# EAGLE design charger (EAGLE 7.0.0)
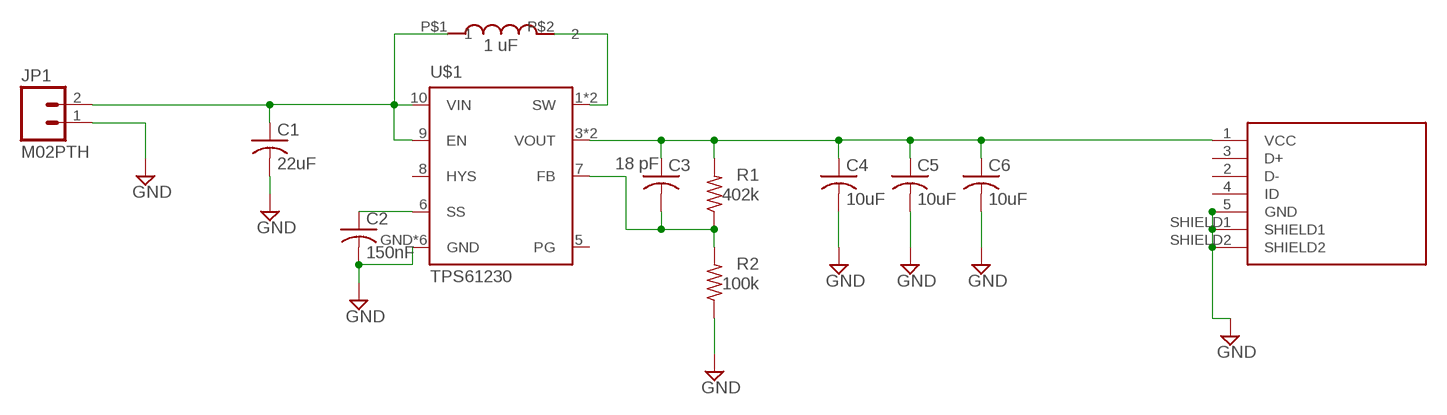
[diagram p0: schematic, sheet 1]

## Parts
C1  22uF  C-USC1206  [C1206]
C2  150nF  C-USC0603K  [C0603K]
C3  18 pF  C-USC0603K  [C0603K]
C4  10uF  C-USC0805K  [C0805K]
C5  10uF  C-USC0805K  [C0805K]
C6  10uF  C-USC0805K  [C0805K]
JP1  M02PTH  [1X02]
R1  402k  R-US_R0603  [R0603]
R2  100k  R-US_R0603  [R0603]
U$1  TPS61230  [DRC-S-PVSON-N11]
U$3  SRU1028  [SRU1028]
U$4  USB2  [USB2]

## Nets
GND: C1.2 C2.2 C4.2 C5.2 C6.2 JP1.1 R2.1 U$1.GND U$1.GND@1(GND) U$1.GND@2(GND) U$1.GND@3(GND) U$1.GND@4(GND) U$1.GND@5(GND) U$4.5(GND) U$4.SHIELD1 U$4.SHIELD2
IND: U$1.1(SW) U$1.2(SW) U$3.P$2
N$3: C2.1 U$1.6(SS)
N$6: C3.2 R1.1 R2.2 U$1.7(FB)
VIN: C1.1 JP1.2 U$1.9(EN) U$1.10(VIN) U$3.P$1
VOUT: C3.1 C4.1 C5.1 C6.1 R1.2 U$1.3(VOUT) U$1.4(VOUT) U$4.1(VCC)
Unconnected: U$1.8(HYS) U$4.2(D-) U$4.3(D+) U$4.4(ID)

## Notes on the sheet
- 1 uF

## Power pins joined to a net without a drawn wire
PG: U$1.5(PG)

## Library data of the parts
C1 C3-C6 = resistor:C-US: CAPACITOR, American symbol
C2 = adafruit:C-US: CAPACITOR, American symbol
JP1 = SparkFun-Connectors:M02: Standard 2-pin 0.1" header. Use with - straight break away headers ( PRT-00116) - right angle break away headers (PRT-00553) - swiss pins (PRT-00743) - machine pins (PRT-00117) - female headers (PRT-00115) Molex polarized connector foot print use with: PRT-08233 with associated crimp pins and housings. 2.54_SCREWTERM for use with PRT-10571. 3.5mm Screw Terminal footprints for PRT-08084 5mm Screw Terminal footprints for use with PRT-08433
R1 R2 = adafruit:R-US_: RESISTOR, American symbol
U$1 = texas:TPS61230
U$3 = ti:SRU1028
U$4 = ti:USB2

## Board
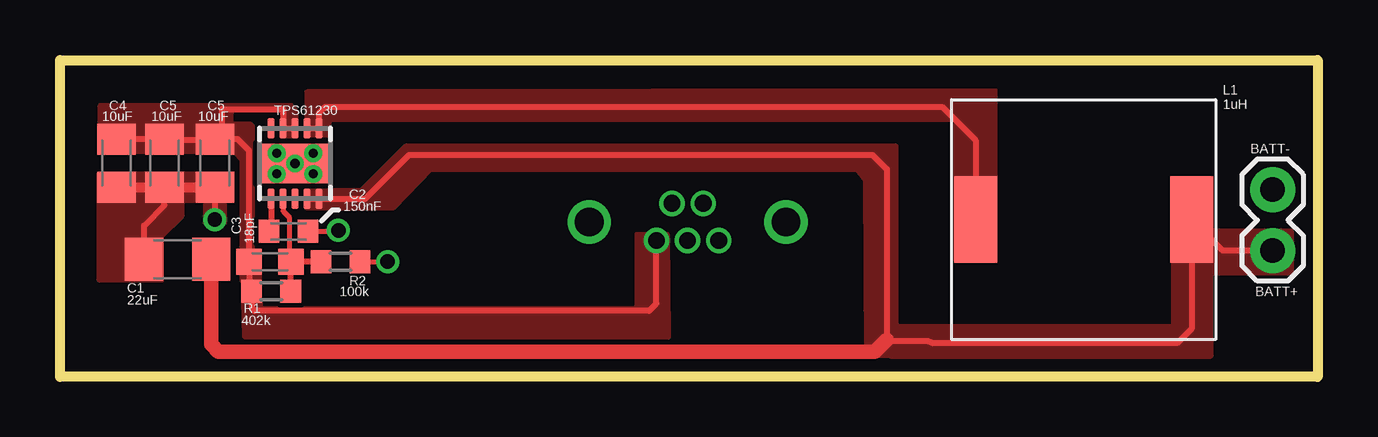
[diagram p1: board, top side]
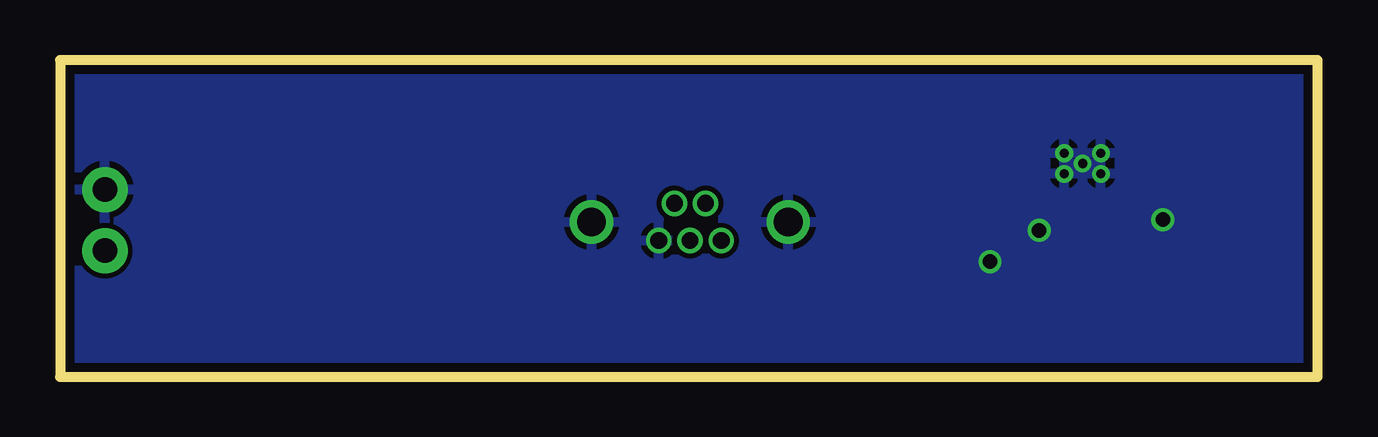
[diagram p2: board, bottom side, seen from below]

Size 52.4 x 13.2 mm. Coordinates in mm from the lower left corner, seen from the top.
Outline: 0,0 0,13.2 52.4,13.2 52.4,0 0,0
Copper layers (1*16): Top 0.0356mm / dielectric 1.5011mm / Bottom 0.0356mm
Design rules "LaenPCBOrder *": minimum track width 6mil, minimum drill 13mil, track to track 8mil, track to pad 8mil, pad to pad 8mil, via to via 8mil, smd to smd 8mil, copper to edge 15mil, drill to drill 6mil, minimum pad ring 7mil, minimum via ring 7mil, stop-mask expansion 0mil, vias tented up to drill 30mil, thermal gap 10mil

### Footprints (pad centres in the part's own frame; a part is rotated, then mirrored left to right if it is on the bottom)
C1206 = smd 1.6 x 1.8: 1 -1.4,0; 2 1.4,0
C0603K = smd 0.864 x 0.965: 1 -0.813,0; 2 0.813,0
C0603K' = smd 1.05 x 1.08: 1 -0.875,0; 2 0.875,0
C0805K = smd 1.3 x 1.6: 1 -1,0; 2 1,0
1X02 = drill 1.016 pad 1.88: 1 0,0; 2 2.54,0
R0603 = smd 0.864 x 0.965: 1 -0.813,0; 2 0.813,0
DRC-S-PVSON-N11 = smd 0.28 x 0.85: 1 -1,-1.475; 2 -0.5,-1.475; 3 0,-1.475; 4 0.5,-1.475; 5 1,-1.475; 6 1,1.475; 7 0.5,1.475; 8 0,1.475; 9 -0.5,1.475; 10 -1,1.475 | smd 3.099 x 1.65: GND 0,0 | drill 0.381 pad 0.559: GND@1 0,0; GND@2 -0.762,0.432; GND@3 -0.762,-0.432; GND@4 0.762,0.432; GND@5 0.762,-0.432
SRU1028 = smd 1.8 x 3.6: P$1 0.9,1.8; P$2 9.9,1.8
USB2 = drill 0.7: 1 2.8,-0.775; 2 3.45,0.775; 3 4.1,-0.775; 4 4.75,0.775; 5 5.4,-0.775 | drill 1.2: SHIELD1 0,0; SHIELD2 8.2,0

### Placement (x,y rotation side)
C1  4.9,4.9 180 top
C2  9.52,6.06 0 top
C3  18 pF  [C0603K']  8.75,4.8 0 top
C4  2.35,8.9 270 top
C5  4.35,8.9 270 top
C6  6.45,8.9 270 top
JP1  50.53,7.8 270 top
R1  8.8,3.57 180 top
R2  11.68,4.79 180 top
U$1  9.79,8.89 180 top
U$3  48.05,8.35 180 top
U$4  22.05,6.45 0 top

### Tracks (layer width: path | path; a pad name or v marks a point on that pad's centre or on a via)
GND  (via drill 0.6)
  Top 0.2: R2.1 13.54,4.79 v13.65,4.8 | C2.2 11.56,6.06 v11.6,6.1
  Top 0.254: C6.2 v6.45,6.55 | C1.2 3.5,6.3 4.35,7.15 C5.2 | U$1.GND@5 9.36,9.32 U$1.GND@1
  Top 0.406: C4.2 C5.2 C6.2
  Bottom 0.254: v6.45,6.55 6.45,6.7
  pour Bottom: 0.1,13.2 52.35,13.2 52.35,0 0.1,0
  pour Top (no thermals): 6,7.2 6,6.4 6.25,6.25 6.65,6.25 6.9,6.4 6.9,7.2
  pour Top (no thermals): 4.25,4.05 1.65,4.05 1.65,8.45 5.05,8.45 5.05,7.05 5.05,6.7 4.2,5.85 4.2,4.1
  pour Top (no thermals): 5.05,8.45 5.8,8.45 5.8,7.35 5.05,7.35
IND
  Top 0.254: U$1.2 U$1.1 10.79,10.99 11.05,11.25 36.75,11.25 38.15,9.85 U$3.P$2
  pour Top (no thermals): 37.35,4.85 38.95,4.9 38.95,11.9 10.3,11.85 10.3,10.1 11.2,10.1 11.2,10.75 37.35,10.75
N$3
  Top 0.254: U$1.6 8.79,6.22 C2.1
N$6
  Top 0.2: U$1.7 9.29,6.91 9.55,6.65 9.55,4.88 C3.2
  Top 0.254: R1.1 9.61,5.04 C3.2 | 9.6,5.08 C3.2 | 9.88,4.8 C3.2 | R2.2 9.64,4.79 C3.2 | 9.55,4.83 C3.2
VIN
  Top 0.254: U$1.10 U$1.9 12.71,7.41 14.55,9.25 33.85,9.25 34.45,8.65 34.45,1.55 34.5,1.5 36.15,1.5 36.4,1.4 46.55,1.4 47.15,2 U$3.P$1 48.44,5.26 JP1.2
  Top 0.61: C1.1 6.3,1.35 6.6,1.05 33.95,1.05 34.45,1.55
  pour Top (no thermals): 10.25,7.75 10.25,7.05 13.9,7.05 15.45,8.65 33.2,8.65 33.55,8.2 33.6,0.9 34.85,0.9 34.85,9.6 14.4,9.6 12.55,7.75
  pour Top (no thermals): 50.9,6.05 47.5,6.05 47.5,4.35 51.3,4.35 51.3,6.05
  pour Top (no thermals): 46.45,4.85 46.45,2.05 34.65,2.05 34.65,0.9 47.9,0.9 47.9,4.9 46.45,4.9
VOUT
  Top 0.254: C6.1 6.45,9.85 4.35,9.85 C5.1 C4.1 | C6.1 6.75,9.9 6.75,11.15 9.3,11.15 9.3,10.95 9.29,10.95 U$1.4 U$1.3 | C6.1 7.4,9.9 7.88,9.43 C3.1 7.88,3.73 R1.2 8,3.61 8,2.85 8.1,2.75 24.55,2.75 24.85,3.05 U$4.1
  pour Top (no thermals): 9.8,10.05 9.3,10.05 9.3,10.95 9.25,11.15 7.2,11.15 7.1,10.95 7.1,9.4 1.7,9.4 1.7,11.3 9.6,11.3 9.8,11.1
  pour Top (no thermals): 6.95,9.3 7.2,9.3 7.15,9.35
  pour Top (no thermals): 7.25,10.55 7.9,10.55 8,10.45 8,5.25 7.6,5.25 7.6,9.05 7.3,9.35 7.15,9.35 7.15,10.5 7.2,10.55
  pour Top (no thermals): 7.6,4 7.6,4.4 8.3,4.4 8.3,3.95 7.65,3.95
  pour Top (no thermals): 8.35,3.2 8.35,2.85 24.05,2.85 24.05,5.95 25.3,5.95 25.35,1.65 7.7,1.65 7.65,3.2

### Text on the board
tNames: L1 | 10uF | C4 | 10uF | C5 | 10uF | C5 | TPS61230 | 1uH | BATT- | 150nF | C2 | C3 | 18pF | C1 | R2 | 22uF | R1 | 100k | BATT+ | 402k